# EasyEDA schematic Schematic.json
TITLE: Sheet_1; REV: 1.0; Date: 2026-08-20; Sheet: 1/1; Drawn By: sadritaneogi; Company: Hack Club
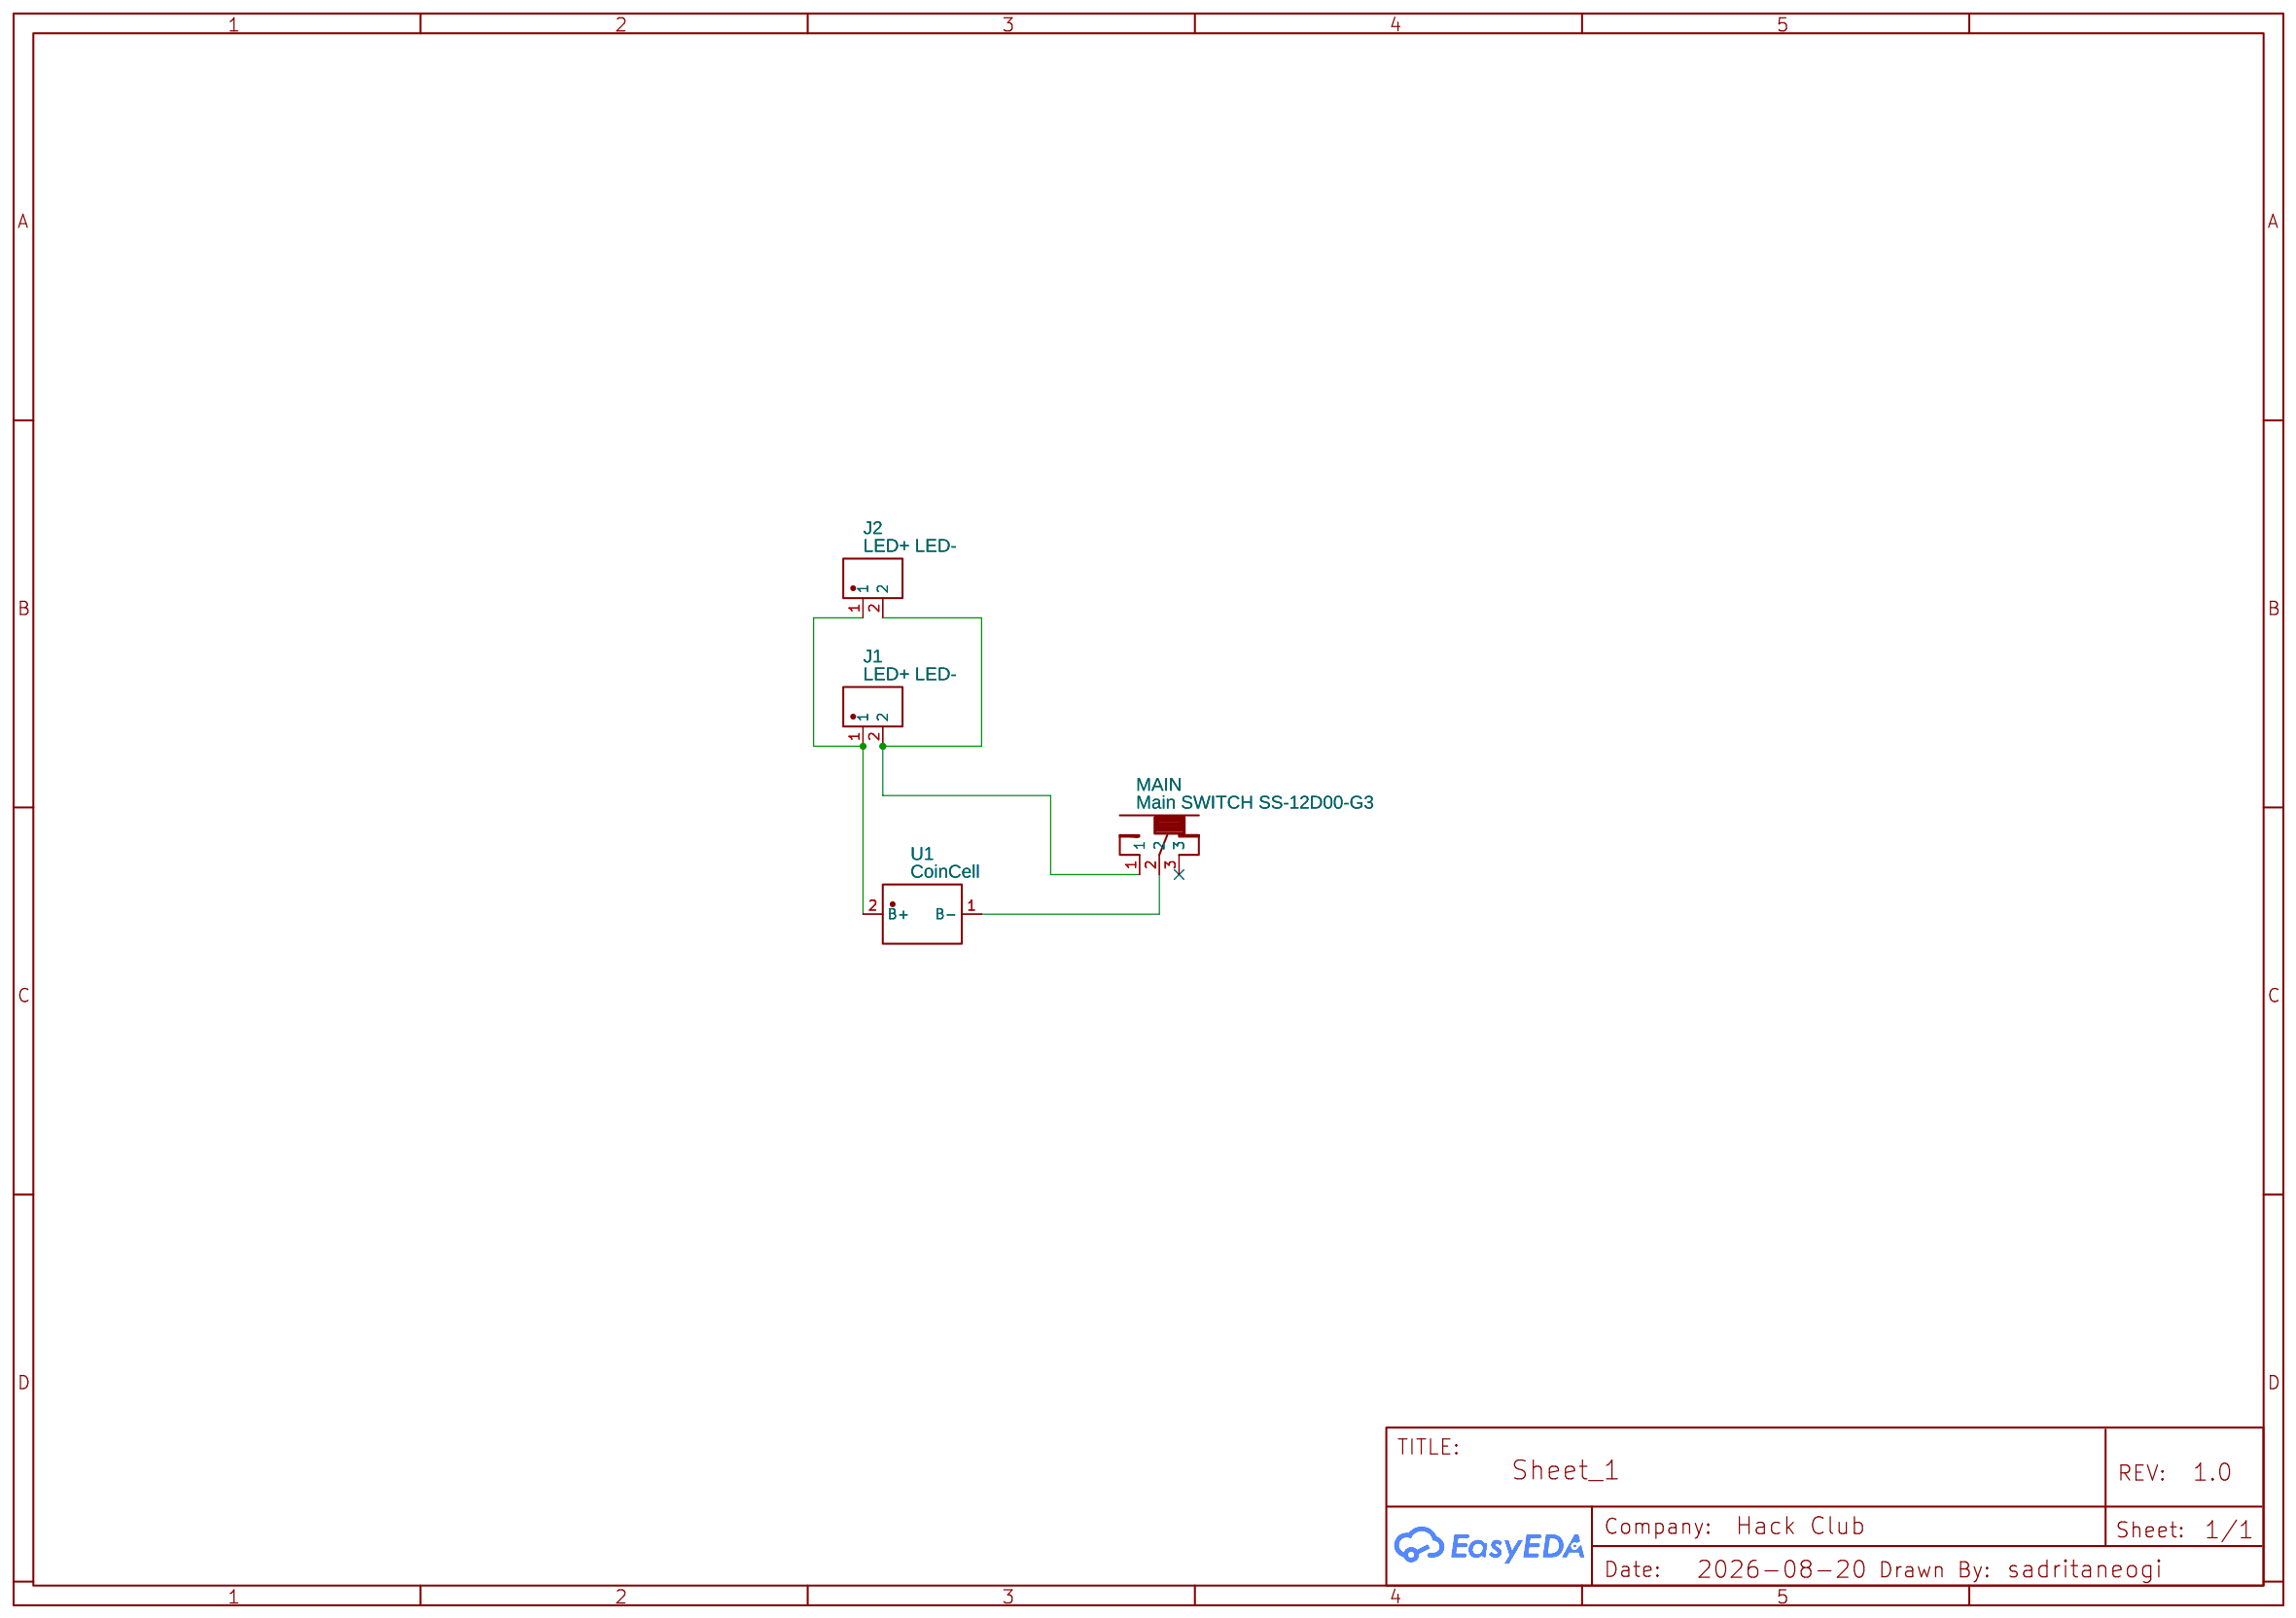
[diagram p0: schematic sheet]

## Parts
J1  LED+ LED-  [LED-3MM_LED-3MM(VERTICAL)]
J2  LED+ LED-  [LED-3MM_LED-3MM(VERTICAL)]
MAIN  Main SWITCH SS-12D00-G3  [SW-TH_SS-12D00-G3]
U1  CoinCell  [BAT-SMD_MY-2032-12]

## Library data of the parts
J1 J2 = LED+ LED-: Supplier: LCSC; Supplier Part: C42431798; Manufacturer: JXTCONN(聚兴泰); Manufacturer Part: PH2.54-1X2P-H25; Contributor: 404andrewtaylor; JLCPCB Part Class: Extended Part; Package Display: No
MAIN = TOGGLE SWITCH SS-12D00-G3: Manufacturer: Dailywell; Contributor: zenaro147; link: https://de.aliexpress.com/item/32756772435.html?spm=a2g0o.productlist.0.0.4e077708sX2Al2&algo_pvid=716abed2-2433-4a4c-8d27-293a4e4961c2&algo_expid=716abed2-2433-4a4c-8d27-293a4e4961c2-8&btsid=2100bddd16119266912771087e59d6&ws_ab_test=searchweb0_0,searchweb201602_,searchweb201603_; Package Display: No
U1 = CoinCell: Contributor: Zachrey; Package Display: No

## Nets
Net-(J1-1): J1.1 J2.1 U1.2(B+)
Net-(J1-2): J1.2 J2.2 MAIN.1
Net-(MAIN-2): MAIN.2 U1.1(B-)

Not connected (* = marked no-connect by the designer): MAIN 3*
